# Altium schematic sheet DSO_CPLD.SchDoc
size A4; SheetNumber: 1; SheetTotal: 11
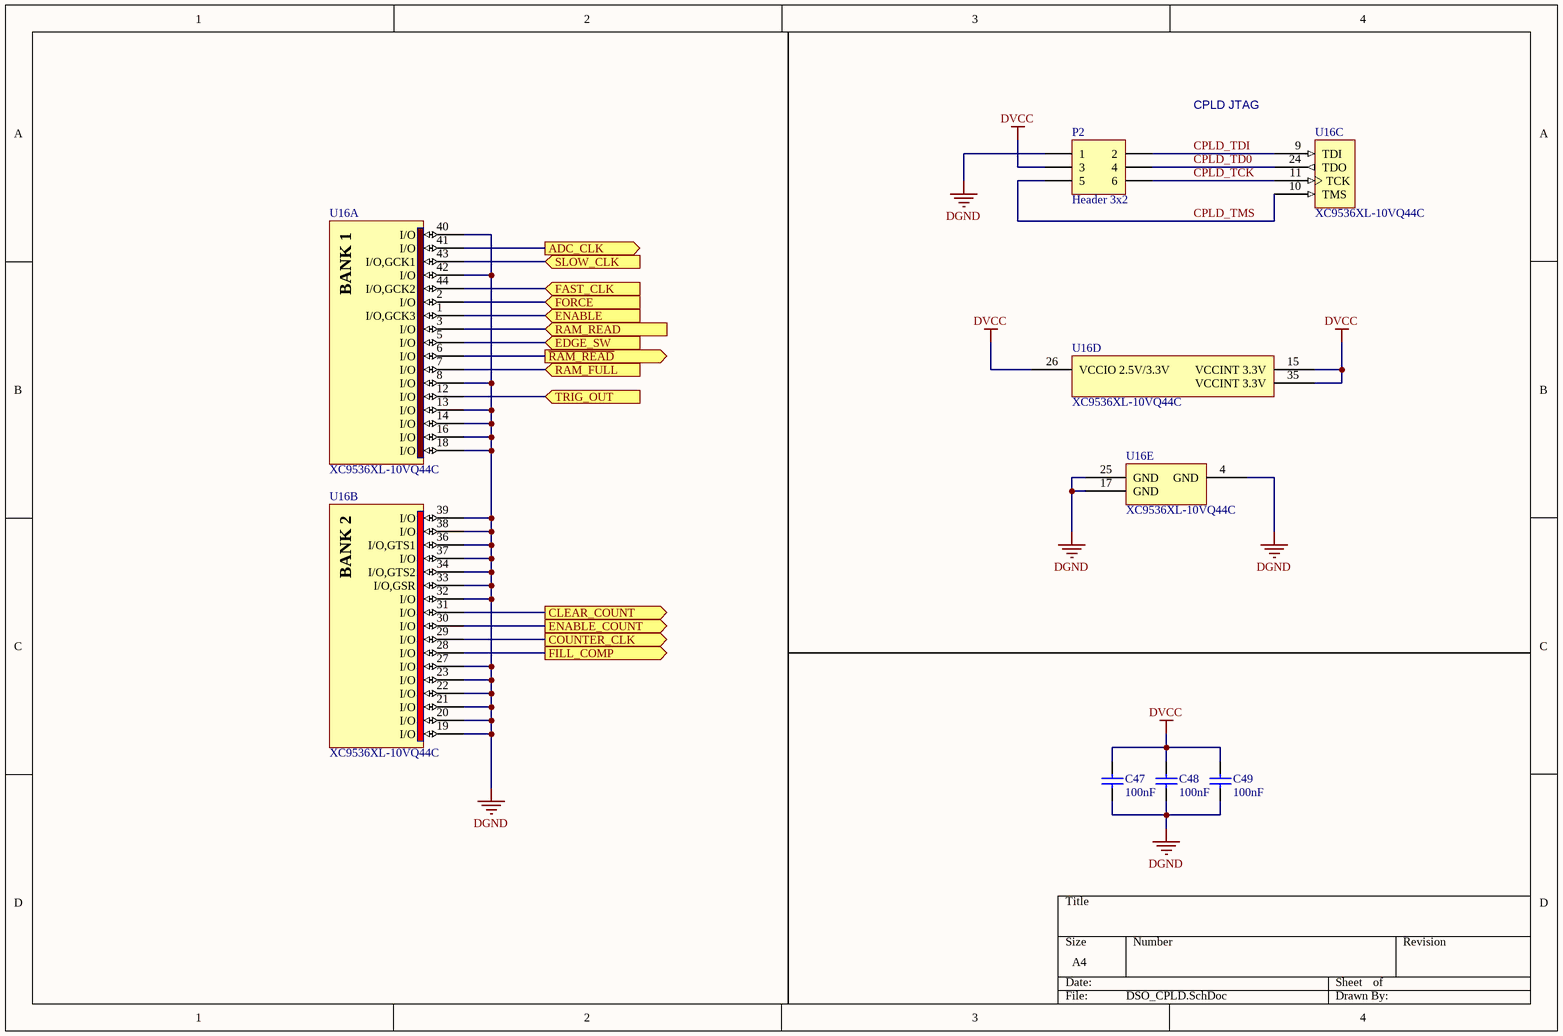
[diagram p0: DSO_CPLD.SchDoc]

## Parts
C47  100nF  [0805C]
C48  100nF  [0805C]
C49  100nF  [0805C]
P2  Header 3x2  [HDR3x2]
U16  XC9536XL-10VQ44C  [VQ44_L]  (parts A,B,C,D,E of 5)

## Ports
ADC_CLK (out), CLEAR_COUNT (out), COUNTER_CLK (out), EDGE_SW (in), ENABLE (in), ENABLE_COUNT (out), FAST_CLK (in), FILL_COMP (out), FORCE (in), RAM_FULL (in), RAM_READ (in), SLOW_CLK (in), TRIG_OUT (in), ~{RAM_READ} (out)

## Nets
DGND: C47.2 C48.2 C49.2 P2.1 U16.4(GND) U16.8(I/O) U16.13(I/O) U16.14(I/O) U16.16(I/O) U16.17(GND) U16.18(I/O) U16.19(I/O) U16.20(I/O) U16.21(I/O) U16.22(I/O) U16.23(I/O) U16.25(GND) U16.27(I/O) U16.32(I/O) U16.33(I/O,GSR) U16.34(I/O,GTS2) U16.36(I/O,GTS1) U16.37(I/O) U16.38(I/O) U16.39(I/O) U16.40(I/O) U16.42(I/O)
DVCC: C47.1 C48.1 C49.1 P2.3 U16.15(VCCINT_3.3V) U16.26(VCCIO_2.5V/3.3V) U16.35(VCCINT_3.3V)
ADC_CLK: U16.41(I/O) ; port ADC_CLK
CLEAR_COUNT: U16.31(I/O) ; port CLEAR_COUNT
COUNTER_CLK: U16.29(I/O) ; port COUNTER_CLK
CPLD_TCK: P2.6 U16.11(TCK)
CPLD_TD0: P2.4 U16.24(TDO)
CPLD_TDI: P2.2 U16.9(TDI)
CPLD_TMS: P2.5 U16.10(TMS)
EDGE_SW: U16.5(I/O) ; port EDGE_SW
ENABLE: U16.1(I/O,GCK3) ; port ENABLE
ENABLE_COUNT: U16.30(I/O) ; port ENABLE_COUNT
FAST_CLK: U16.44(I/O,GCK2) ; port FAST_CLK
FILL_COMP: U16.28(I/O) ; port FILL_COMP
FORCE: U16.2(I/O) ; port FORCE
~{RAM_READ}: U16.6(I/O) ; port ~{RAM_READ}
RAM_FULL: U16.7(I/O) ; port RAM_FULL
RAM_READ: U16.3(I/O) ; port RAM_READ
SLOW_CLK: U16.43(I/O,GCK1) ; port SLOW_CLK
TRIG_OUT: U16.12(I/O) ; port TRIG_OUT

## Notes on the sheet
- CPLD JTAG
- (in symbol XC9536XL-10VQG44C, part A) BANK 1
- (in symbol XC9536XL-10VQG44C, part B) BANK 2

## Library data of the parts
C47-C49 = C: Capacitor; Reviewed by: RM - 2018/08/05; Revision: July-2002: Re-released for DXP Platform.; Value: 100nF; Supplier 1: *; Supplier Part Number 1: *
P2 = Header 3x2: Header, 5-Pin; Reviewed by: RM - 2018/08/05; Supplier 1: Digi-Key; Supplier Part Number 1: 952-2121-ND
U16 = XC9536XL-10VQG44C: FastFLASH XC900XL, 3.3V High-Performance 36 Macrocell CPLD, 34 User I/Os, 44-Pin VQFP, Speed Grade 10, Commercial Grade; Reviewed by: RM - 2018/08/05; Supplier 1: Digi-Key; Supplier Part Number 1: 122-1385-ND